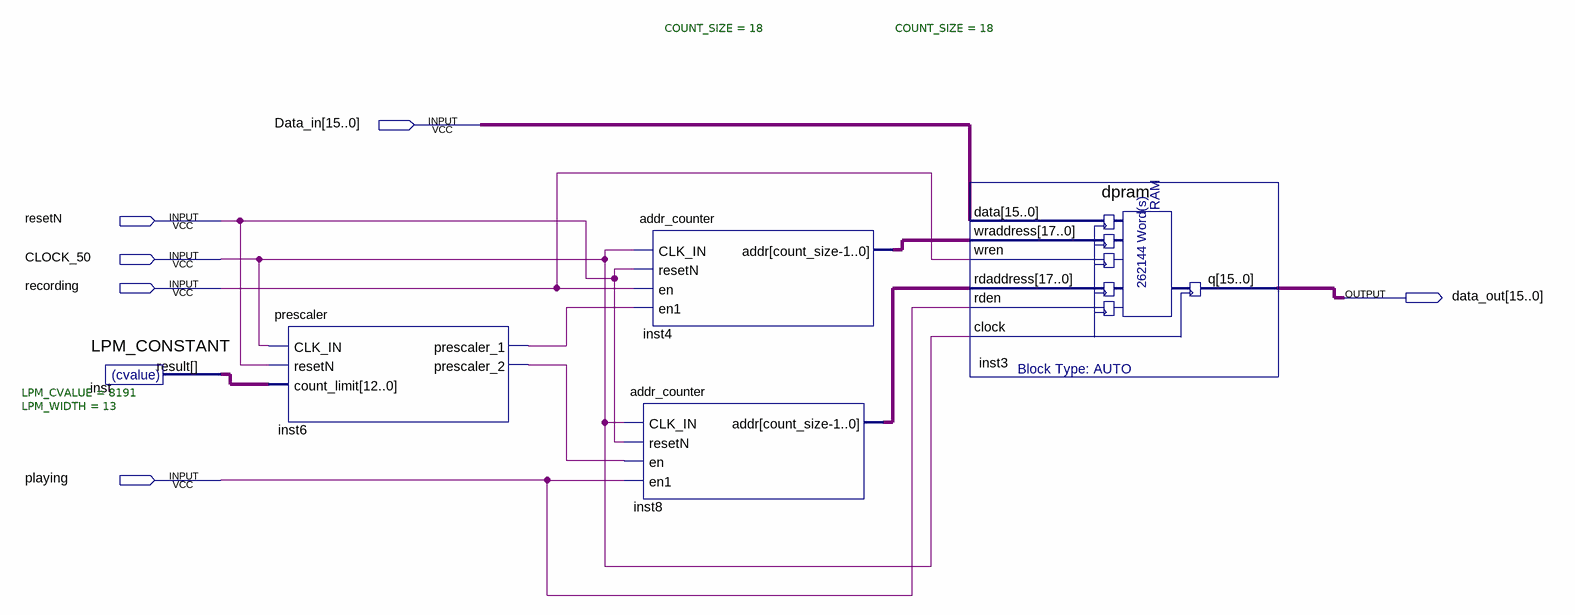
[diagram p0: schematic sheet]
// Quartus schematic recorder_module.bdf as structural Verilog: 5 symbols, 6 pins
module recorder_module (
  input  [15:0] Data_in,
  input  resetN,
  input  CLOCK_50,
  input  recording,
  input  playing,
  output [15:0] data_out
);

  wire inst6_prescaler_1, inst6_prescaler_2;
  wire [12:0] inst_result;
  wire [17:0] inst4_addr, inst8_addr;

  LPM_CONSTANT #(.LPM_CVALUE(8191), .LPM_WIDTH(13)) inst (.result(inst_result));
  prescaler inst6 (
    .CLK_IN(CLOCK_50), .resetN(resetN), .count_limit(inst_result), .prescaler_1(inst6_prescaler_1),
    .prescaler_2(inst6_prescaler_2));
  addr_counter #(.COUNT_SIZE(18)) inst4 (
    .CLK_IN(CLOCK_50), .resetN(resetN), .en(recording), .en1(inst6_prescaler_1), .addr(inst4_addr));
  addr_counter #(.COUNT_SIZE(18)) inst8 (
    .CLK_IN(CLOCK_50), .resetN(resetN), .en(inst6_prescaler_2), .en1(playing), .addr(inst8_addr));
  dpram inst3 (
    .data(Data_in), .wraddress(inst4_addr), .wren(recording), .rdaddress(inst8_addr), .rden(playing),
    .clock(CLOCK_50), .q(data_out));
endmodule
